# EAGLE design driver_board_one_module_pic_v2 (EAGLE 8.1.1)
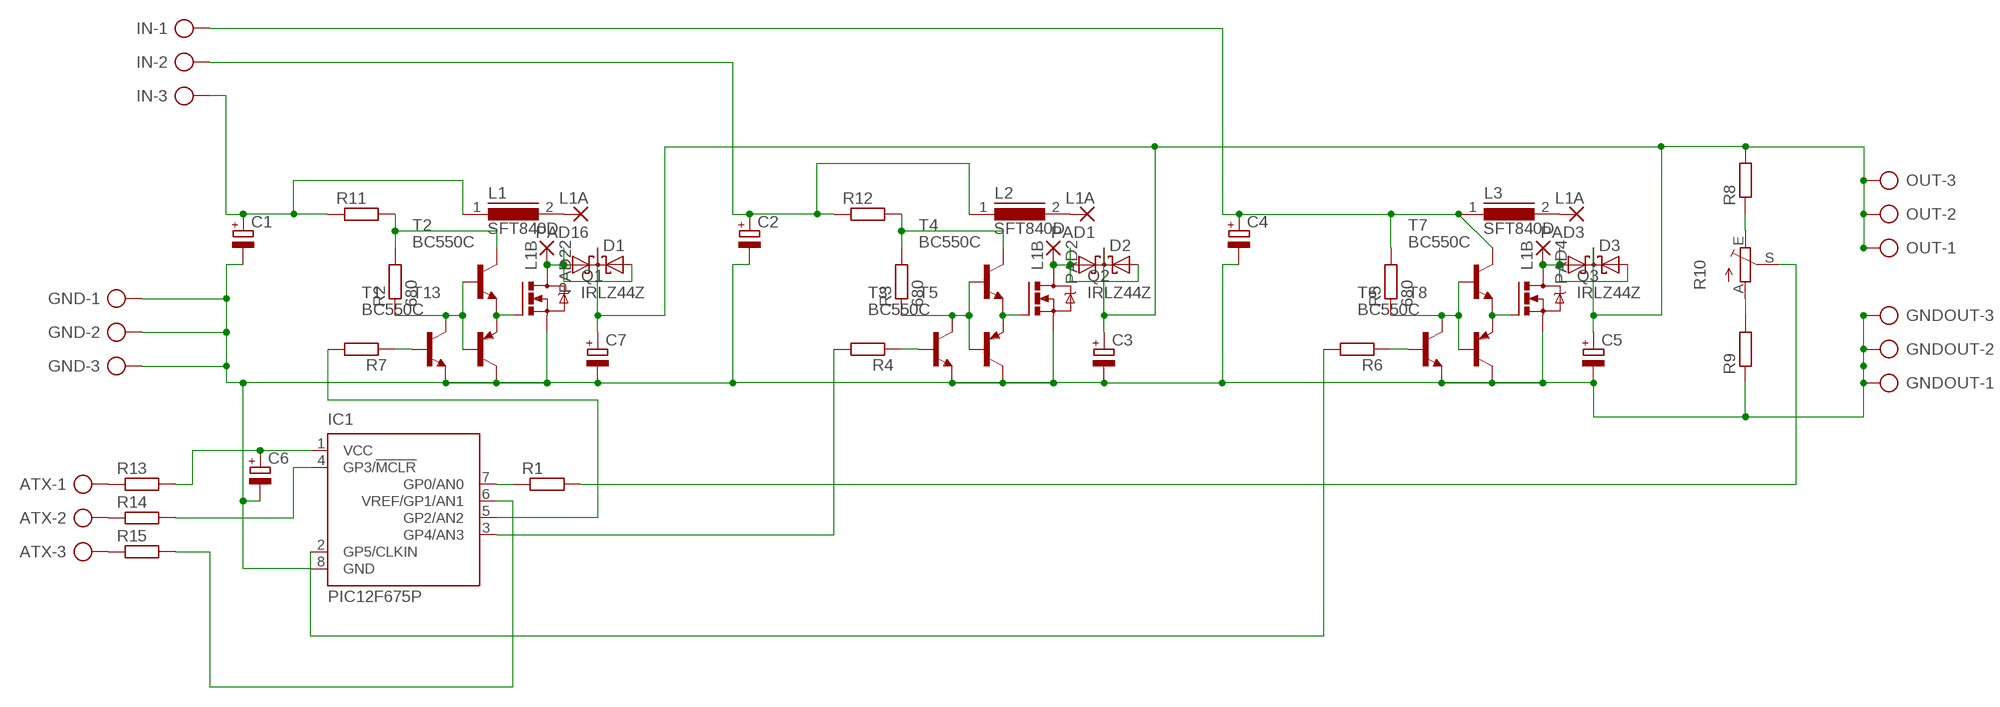
[diagram p0: schematic, sheet 1]

## Parts
ATX  AK300/3  [AK300/3]
C1  CPOL-EUE5-8.5  [E5-8,5]
C2  CPOL-EUE5-8.5  [E5-8,5]
C3  CPOL-EUE5-8.5  [E5-8,5]
C4  CPOL-EUE5-8.5  [E5-8,5]
C5  CPOL-EUE5-8.5  [E5-8,5]
C6  CPOL-EUE5-8.5  [E5-8,5]
C7  CPOL-EUE5-8.5  [E5-8,5]
D1  DIODE_2SCHOTTKY-SOT93V  [SOT93S]
D2  DIODE_2SCHOTTKY-SOT93V  [SOT93S]
D3  DIODE_2SCHOTTKY-SOT93V  [SOT93S]
GND  AK300/3  [AK300/3]
GNDOUT  AK300/3  [AK300/3]
IC1  PIC12F675P  [DIL8]
IN  AK300/3  [AK300/3]
L1  SFT840D  [SFT840D]
L2  SFT840D  [SFT840D]
L3  SFT840D  [SFT840D]
OUT  AK300/3  [AK300/3]
PAD1  L1A  3,81/1,1  [3,81/1,1]
PAD2  L1B  3,81/1,1  [3,81/1,1]
PAD3  L1A  3,81/1,1  [3,81/1,1]
PAD4  L1B  3,81/1,1  [3,81/1,1]
PAD16  L1A  3,81/1,1  [3,81/1,1]
PAD22  L1B  3,81/1,1  [3,81/1,1]
Q1  IRLZ44Z  [TO220BH]
Q2  IRLZ44Z  [TO220BH]
Q3  IRLZ44Z  [TO220BH]
R1  R-EU_0207/7  [0207/7]
R2  680  R-EU_0204/7  [0204/7]
R3  680  R-EU_0204/7  [0204/7]
R4  R-EU_0207/10  [0207/10]
R5  680  R-EU_0204/7  [0204/7]
R6  R-EU_0207/10  [0207/10]
R7  R-EU_0207/7  [0207/7]
R8  R-EU_0207/7  [0207/7]
R9  R-EU_0207/7  [0207/7]
R10  TRIM_EU-RJ9W  [RJ9W]
R11  R-EU_0207/10  [0207/10]
R12  R-EU_0207/15  [0207/15]
R13  R-EU_0207/10  [0207/10]
R14  R-EU_0207/10  [0207/10]
R15  R-EU_0207/10  [0207/10]
T1  BC550C  [TO92-EBC]
T2  BC550C  [TO92-EBC]
T3  BC550C  [TO92-EBC]
T4  BC550C  [TO92-EBC]
T5  BC557C-PNP-TO92-EBC  [TO92-EBC]
T6  BC550C  [TO92-EBC]
T7  BC550C  [TO92-EBC]
T8  BC557C-PNP-TO92-EBC  [TO92-EBC]
T13  BC557C-PNP-TO92-EBC  [TO92-EBC]

## Nets
GND: C1.- C2.- C3.- C4.- C5.- C6.- C7.- GND.1 GND.2 GND.3 GNDOUT.1 GNDOUT.2 GNDOUT.3 IC1.8(GND) Q1.S Q2.S Q3.S R9.1 T1.E T3.E T5.C T6.E T8.C T13.C
N$1: Q1.G T2.E T13.E
N$2: IC1.7(GP0/AN0) R1.1
N$3: Q2.G T4.E T5.E
N$4: R3.1 T3.C T4.B T5.B
N$5: R9.2 R10.A
N$6: R4.1 T3.B
N$7: R2.1 T1.C T2.B T13.B
N$8: ATX.1 R13.1
N$9: D2.A1 D2.A2 PAD2.1(P) Q2.D
N$10: R8.1 R10.E
N$11: L2.2 PAD1.1(P)
N$12: Q3.G T7.E T8.E
N$13: ATX.2 R14.1
N$14: R5.1 T6.C T7.B T8.B
N$15: R1.2 R10.S
N$16: R6.1 T6.B
N$17: R2.2 R11.2 T2.C
N$18: D3.A1 D3.A2 PAD4.1(P) Q3.D
N$19: ATX.3 R15.1
N$20: R7.1 T1.B
N$21: L3.2 PAD3.1(P)
N$22: IC1.5(GP2/AN2) R7.2
N$23: IC1.3(GP4/AN3) R4.2
N$24: IC1.2(GP5/CLKIN) R6.2
N$25: C6.+ IC1.1(VCC) R13.2
N$26: IC1.4(GP3/!MCLR) R14.2
N$27: IC1.6(VREF/GP1/AN1) R15.2
N$28: C1.+ IN.3 L1.1 R11.1
N$29: C2.+ IN.2 L2.1 R12.1
N$30: C4.+ IN.1 L3.1 R5.2 T7.C
N$31: R3.2 R12.2 T4.C
N$33: L1.2 PAD16.1(P)
N$34: D1.A1 D1.A2 PAD22.1(P) Q1.D
N$35: C3.+ C5.+ C7.+ D1.C D2.C D3.C OUT.1 OUT.2 OUT.3 R8.2

## Library data of the parts
ATX GND GNDOUT IN OUT = con-ptr500:AK300/3: CONNECTOR; OC_FARNELL: unknown; OC_NEWARK: unknown
C1-C7 = rcl:CPOL-EU: POLARIZED CAPACITOR, European symbol
D1-D3 = diode:DIODE_2SCHOTTKY-: Dual SCHOTTKY DIODE common cathode
IC1 = microchip:PIC12F675: 8-Pin FLASH-Based 8-Bit CMOS Microcontroller Precision Internal 4 MHz oscillator factory calibrated to ±1% Low Power Features: Standby Current: - 1 nA @ 2.0V, typical Operating Current: - 8.5µA @ 32 kHz, 2.0V, typical - 100µA @ 1 MHz, 2.0V, typical Watchdog Timer Current: - 300 nA @ 2.0V, typical Timer1 oscillator current: - 4µA @ 32 kHz, 2.0V, typical Analog-to-Digital Converter module: - 10-bit resolution - Programmable 4-channel input - Voltage reference input Source: http://www.microchip.com .. 41190E.pdf; MF: MICROCHIP; MPN: PIC12F675-E/P; OC_FARNELL: 9759018; OC_NEWARK: 92C4340
L1-L3 = inductors:SFT840D: INDUCTOR
PAD1-PAD4 PAD16 PAD22 = wirepad:3,81/1,1: THROUGH-HOLE PAD
Q1-Q3 = transistor-power:IRLZ44Z: N-Channel HEXFET® Power MOSFET Logic Level AUTOMOTIVE MOSFET Source: http://www.irf.com/product-info/datasheets/data/irlz44zpbf.pdf
R1-R3 R5 R7-R9 R11 R13-R15 = resistor:R-EU_: RESISTOR, European symbol
R4 R6 R12 = rcl:R-EU_: RESISTOR, European symbol
R10 = pot:TRIM_EU-: POTENTIOMETER
T1-T4 T6 T7 = transistor-npn:BC550*: NPN Transistor
T5 T8 T13 = transistor:*-PNP-: PNP Transistror

## Board
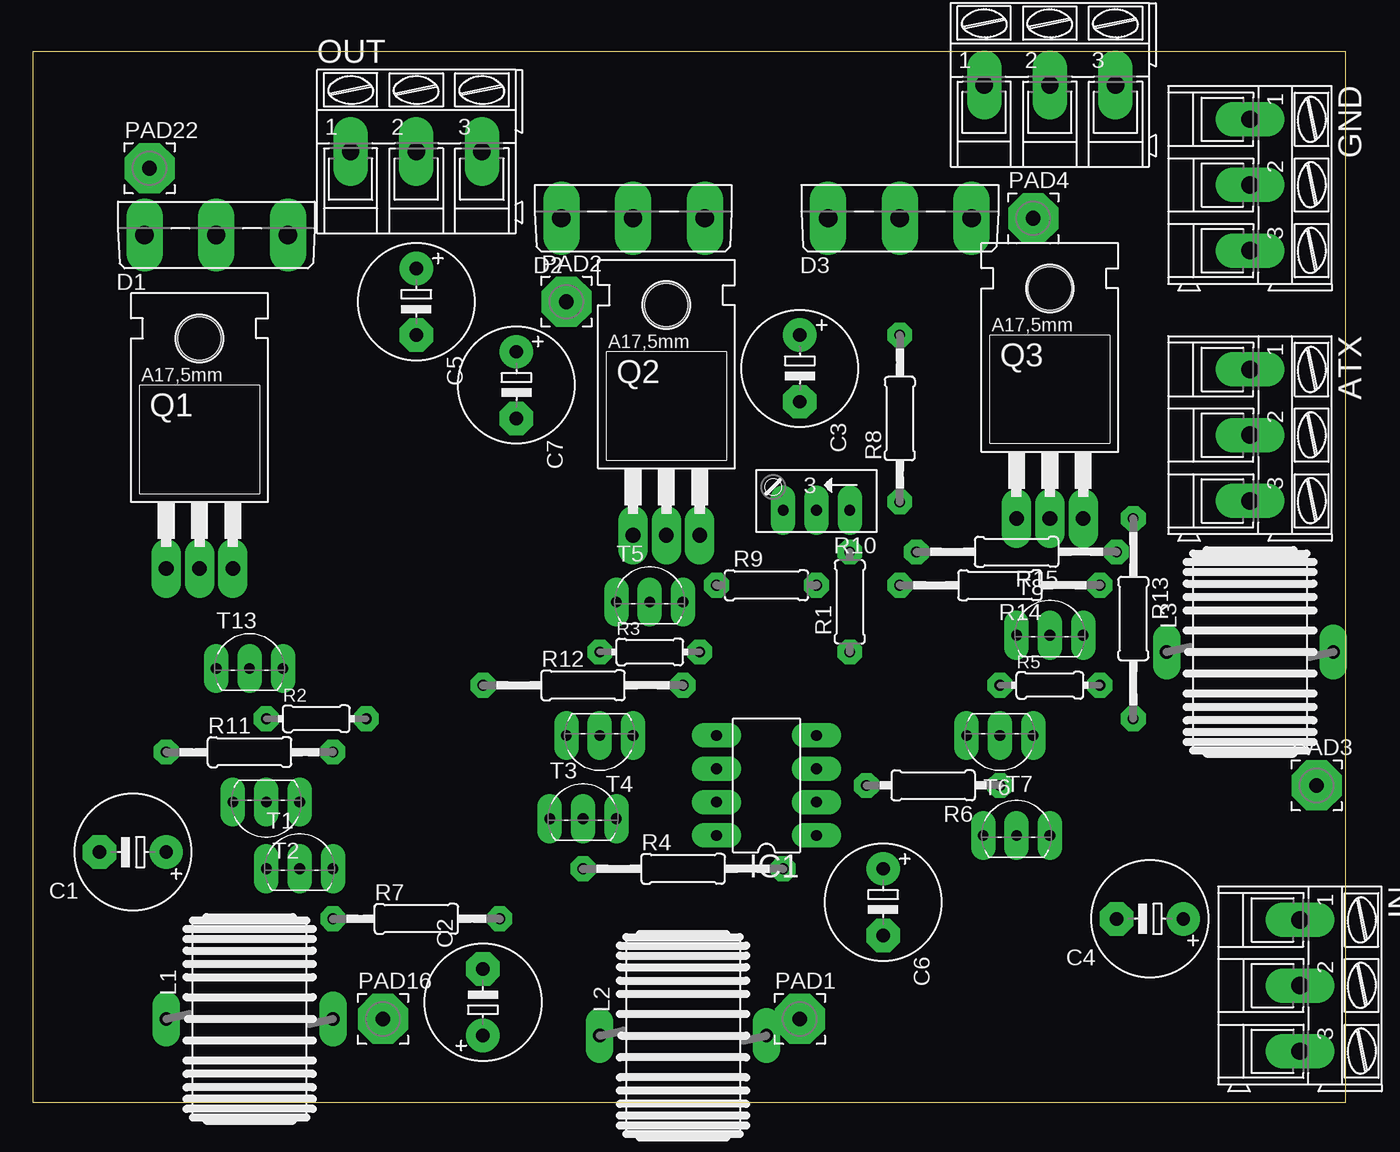
[diagram p1: board, top side]
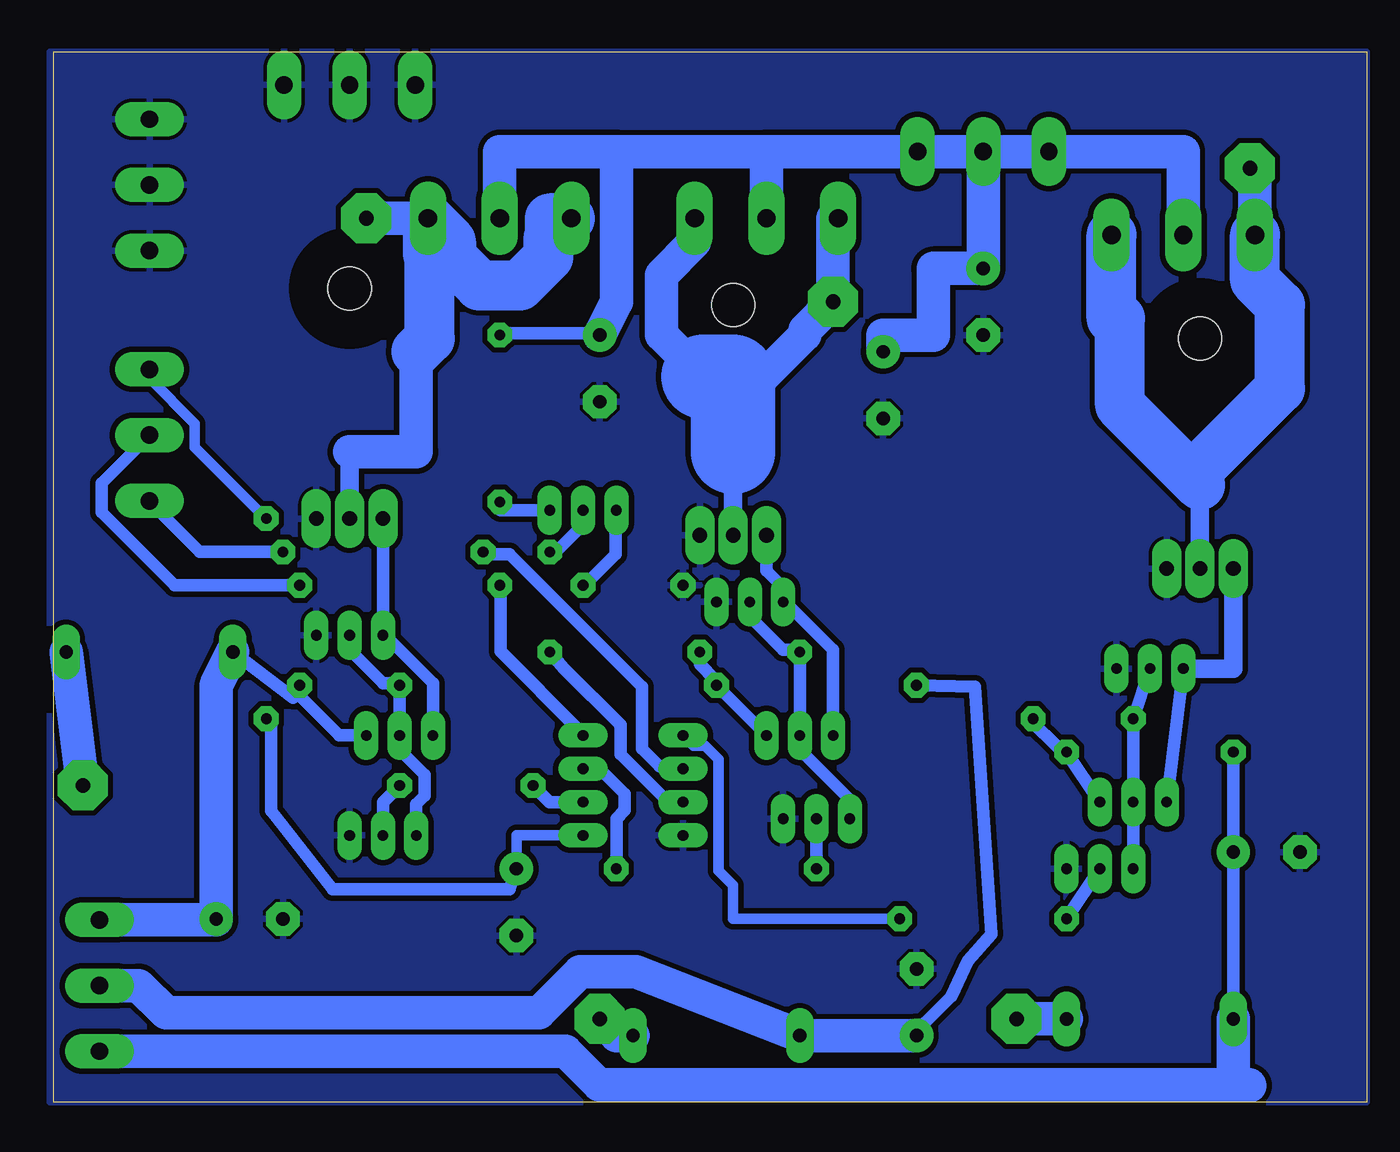
[diagram p2: board, bottom side, seen from below]

Size 100 x 80 mm. Coordinates in mm from the lower left corner, seen from the top.
Outline: 0,0 100,0 100,80 0,80 0,0
Copper layers (1*16): Top 0.035mm / dielectric 1.5mm / Bottom 0.035mm
Design rules "default *": minimum track width 38mil, minimum drill 31mil, track to track 15mil, track to pad 16mil, pad to pad 15mil, via to via 16mil, smd to smd 7mil, copper to edge 0mil, drill to drill 8mil, minimum pad ring 21mil, minimum via ring 8mil, stop-mask expansion 4mil, vias tented up to drill 0mil, thermal gap 10mil

### Footprints (pad centres in the part's own frame; a part is rotated, then mirrored left to right if it is on the bottom)
AK300/3 = drill 1.321 long: 1 -5.004,0; 2 0,0; 3 5.004,0
E5-8,5 = drill 1.016 pad 2.54: + -2.54,0 | drill 1.016 pad 2.54 octagon: - 2.54,0
SOT93S = drill 1.397 long: A1 -5.461,-2.54; A2 5.461,-2.54; C 0,-2.54
DIL8 = drill 0.813 long: 1 -3.81,-3.81; 2 -1.27,-3.81; 3 1.27,-3.81; 4 3.81,-3.81; 5 3.81,3.81; 6 1.27,3.81; 7 -1.27,3.81; 8 -3.81,3.81
SFT840D = drill 1.016 long: 1 -6.35,0; 2 6.35,0
3,81/1,1 = drill 1.118 pad 3.81 octagon: 1 0,0
TO220BH = drill 1.118 long: D 0,-6.35; G -2.54,-6.35; S 2.54,-6.35 | hole 3.302: 0,11.176
0207/7 = drill 0.813 octagon: 1 -3.81,0; 2 3.81,0
0204/7 = drill 0.813 octagon: 1 -3.81,0; 2 3.81,0
0207/15 = drill 0.813 octagon: 1 -7.62,0; 2 7.62,0
0207/10 = drill 0.813 octagon: 1 -5.08,0; 2 5.08,0
0207/12 = drill 0.813 octagon: 1 -6.35,0; 2 6.35,0
RJ9W = drill 0.813 long: A 2.54,0.635; E -2.54,0.635; S 0,0.635
TO92-EBC = drill 0.813 long: B 0,-1.27; C -2.54,-1.27; E 2.54,-1.27
TO92-EBC' = drill 0.813 long: B 0,-1.27; C 2.54,-1.27; E -2.54,-1.27

### Placement (x,y rotation side)
ATX  92.71,50.8 270 top
C1  7.62,19.05 180 top
C2  34.29,7.62 90 top
C3  58.42,55.88 270 top
C4  85.09,13.97 180 top
C5  29.21,60.96 270 top
C6  64.77,15.24 270 top
C7  36.83,54.61 270 top
D1  13.97,68.58 0 top
D2  45.72,69.85 0 top
D3  66.04,69.85 0 top
GND  92.71,69.85 270 top
GNDOUT  77.47,77.47 0 top
IC1  55.88,24.13 90 top
IN  96.52,8.89 270 top
L1  16.51,6.35 0 top
L2  49.53,5.08 0 top
L3  92.71,34.29 0 top
OUT  29.21,72.39 0 top
PAD1  58.42,6.35 0 top
PAD2  40.64,60.96 0 top
PAD3  97.79,24.13 0 top
PAD4  76.2,67.31 0 top
PAD16  26.67,6.35 0 top
PAD22  8.89,71.12 0 top
Q1  12.7,46.99 0 top
Q2  48.26,49.53 0 top
Q3  77.47,50.8 0 top
R1  62.23,38.1 90 top
R2  21.59,29.21 0 top
R3  46.99,34.29 0 top
R4  [0207/15]  49.53,17.78 0 top
R5  77.47,31.75 0 top
R6  68.58,24.13 180 top
R7  [0207/12]  29.21,13.97 0 top
R8  [0207/12]  66.04,52.07 90 top
R9  55.88,39.37 0 top
R10  59.69,45.72 180 top
R11  [0207/12]  16.51,26.67 0 top
R12  41.91,31.75 0 top
R13  [0207/15]  83.82,36.83 270 top
R14  [0207/15]  73.66,39.37 180 top
R15  [0207/15]  74.93,41.91 180 top
T1  20.32,19.05 0 top
T2  17.78,21.59 180 top
T3  41.91,22.86 0 top
T4  43.18,26.67 180 top
T5  [TO92-EBC']  46.99,39.37 0 top
T6  74.93,21.59 0 top
T7  73.66,26.67 180 top
T8  [TO92-EBC']  77.47,36.83 0 top
T13  [TO92-EBC']  16.51,34.29 0 top

### Tracks (layer width: path | path; a pad name or v marks a point on that pad's centre or on a via)
GND
  pour Bottom (isolate 0.406): 0,80.01 100.33,80.01 100.33,0 0,0
N$1
  Bottom 0.965: T2.E T13.E
  Bottom 1.422: T13.E 10.16,33.02 Q1.G
N$2
  Bottom 0.965: IC1.7 53.18,22.86 56.83,26.51 56.83,28.73 61.12,33.02 R1.1
N$3
  Bottom 0.965: T4.E 40.64,34.45 44.29,38.1 T5.E 44.61,38.58 44.61,39.37 45.72,40.48 Q2.G
N$4
  Bottom 0.965: T3.C 39.37,23.02 43.18,26.83 T4.B R3.1 43.66,34.45 44.45,34.45 46.99,36.99 T5.B
N$5
  Bottom 0.965: R10.A 57.21,44.42 57.21,41.73 59.23,39.71 R9.2
N$6
  Bottom 0.965: T3.B R4.1
N$7
  Bottom 0.965: T13.B R2.1 T2.B T1.C
N$8
  Bottom 0.813: 92.71,55.88 92.71,55.14 89.26,51.68 89.26,49.89 R13.1
  Bottom 1.422: ATX.1 92.71,55.88
N$9
  Bottom 1.422: 48.26,49.53 Q2.D
  Bottom 2.54: D2.A1 40.64,67.31 PAD2.1 42.8,58.8 42.8,58.44 46,55.24 50.52,55.24 53.72,58.44 53.72,62.97 51.18,65.51 D2.A2
  Bottom 6.452: 50.52,55.24 48.26,55.24 48.26,49.53
N$10
  Bottom 0.965: R10.E 62.6,45.1 65.96,45.1 R8.1
N$11
  Bottom 2.54: L2.2 57.15,5.08 PAD1.1
N$12
  Bottom 0.965: T7.E 71.12,31.91 74.77,35.56 T8.E Q3.G
N$13
  Bottom 0.965: R14.1 90.81,39.37 96.36,44.93 96.36,47.15 ATX.2
N$14
  Bottom 0.965: T6.C 72.39,22.7 71.75,23.34 71.75,24.92 73.66,26.83 T7.B R5.1 74.14,31.91 74.93,31.91 77.47,34.45 T8.B
N$15
  Bottom 0.965: R1.2 61.92,41.73 59.23,44.42 R10.S
N$16
  Bottom 0.965: T6.B 74.93,22.86 R6.1
N$17
  Bottom 0.965: T2.C R11.2 23.34,26.83 25.72,29.21 R2.2
N$18
  Bottom 0.965: PAD4.1 75.08,67.31
  Bottom 1.422: Q3.D 77.47,49.53 | 60.96,67.31 D3.A1 60.96,67.31 | 60.96,67.31 60.96,66.04 63.5,66.04 63.5,62.2 64.5,62.2
  Bottom 2.54: D3.A2 75.08,67.31 75.21,67.44 76.2,67.44 | 77.47,49.53 72.39,49.53 72.39,57.15
  Bottom 3.81: 72.39,57.15 71.37,58.17 71.37,64.5 71.5,64.63 D3.A2 69.75,65.56 69.75,64.38 67.58,62.2 64.5,62.2 62.33,64.38 62.33,65.68 60.71,67.31 | 60.96,67.31 62.23,67.31 62.23,66.04
N$19
  Bottom 0.965: R15.1 88.9,41.91 92.71,45.72 ATX.3
N$20
  Bottom 0.965: T1.B R7.1
N$21
  Bottom 2.54: L3.2 PAD3.1
N$22
  Bottom 0.813: R7.2 48.26,13.97 48.26,16.51 49.38,17.63 49.38,26.13 50.4,27.15 51.28,27.15 IC1.5
N$23
  Bottom 0.965: R4.2 57.15,21.59 56.52,22.23 56.52,23.5 58.42,25.4 IC1.3
N$24
  Bottom 0.965: IC1.2 62.23,22.86 R6.2
N$25
  Bottom 0.813: IC1.1 64.77,20.32 C6.+
  Bottom 0.965: R13.2 83.46,28.94 83.46,22.21 78.75,16.23 65.29,16.23 C6.+
N$26
  Bottom 0.965: IC1.4 59.91,28.27 65.96,34.33 65.96,39.04 R14.2
N$27
  Bottom 0.965: IC1.6 52.5,25.58 53.85,25.58 55.19,26.92 55.19,31.64 65.29,41.73 67.31,41.73 R15.2
N$28
  Bottom 0.965: R11.1 C1.+ L1.1
  Bottom 2.54: IN.3 61.02,3.89 58.46,1.32 8.94,1.32 8.89,1.27 10.16,1.27 L1.1
N$29
  Bottom 0.965: R12.1 29.84,31.64 28.57,12.79 30.37,10.77 31.64,8.08 33.66,6.06 C2.+
  Bottom 2.54: IN.2 93.52,8.89 91.44,6.81 63.03,6.81 59.9,9.93 55.65,9.93 L2.1 C2.+
N$30
  Bottom 0.965: T7.C 78.26,27.94 81.44,31.11 | 81.44,31.11 R5.2 | 81.44,31.11 81.76,30.8 L3.1
  Bottom 2.54: IN.1 87.63,13.89 C4.+ 87.63,31.75 L3.1
N$31
  Bottom 0.965: T4.C R12.2 49.69,32.23 50.8,33.34 R3.2
N$33
  Bottom 2.54: L1.2 PAD16.1
N$34
  Bottom 1.422: Q1.D 12.7,46.99 12.7,48.26
  Bottom 2.54: PAD22.1 8.51,71.12 D1.A1
  Bottom 3.81: D1.A1 8.51,62.6 6.6,60.69 6.6,54.36 12.7,48.26 | 12.7,46.99 18.8,53.09 18.8,59.69 19.43,59.69 D1.A2
N$35
  Bottom 0.965: R8.2 65.96,58.56 59.23,58.56 C3.+
  Bottom 2.54: D1.C 13.97,72.39 OUT.1 OUT.2 | OUT.2 OUT.3 45.72,72.39 | D2.C 45.72,72.39 | 57.15,72.39 45.72,72.39 | 57.15,72.39 66.04,72.39 D3.C | C3.+ 57.15,60.96 57.15,72.39 | OUT.2 C5.+ 33.02,63.5 33.02,58.42 36.83,58.42 C7.+